# Altium schematic sheet changable resistor.schdoc
size 41 x 28 mm
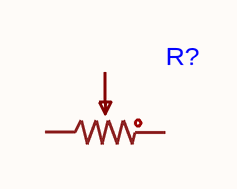
[diagram p0: changable resistor.schdoc]

## Parts
R?  (no value)  [RES-ADJ-SMD_TC33X-2-104E]

## Nets

Not connected (* = marked no-connect by the designer): R? 1 2 3

## Library data of the parts
R? = TC33X-2-104E